# Altium project PCB_Practise_Enterprise.PrjPcb
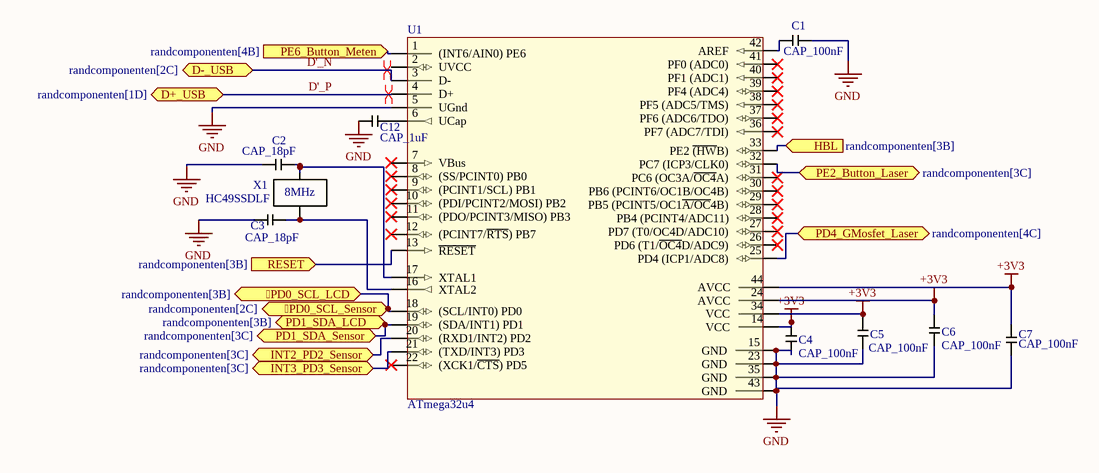
[diagram p0: chip.SchDoc]
2 sheets, 43 parts. Net scope: flat (ports and power ports of the same name join across sheets).
Board file: PCB2.PcbDoc
Sheets:
  chip.SchDoc
  randcomponenten.SchDoc

## Sheet chip.SchDoc
size A; SheetNumber: 1; SheetTotal: 2

### Parts
C1  CAP_100nF  [CAP_100nF]
C2  CAP_18pF  [CAP_18pF]
C3  CAP_18pF  [CAP_18pF]
C4  CAP_100nF  [CAP_100nF]
C5  CAP_100nF  [CAP_100nF]
C6  CAP_100nF  [CAP_100nF]
C7  CAP_100nF  [CAP_100nF]
C12  CAP_1uF  [CAP_1uF]
U1  ATmega32u4  [Atmega32u4]
X1  HC49SSDLF  [Xtal_HC49SSDLF]

### Ports
PD0_SCL_LCD (bidir, see randcomponenten[3B]), PD0_SCL_Sensor (bidir, see randcomponenten[2C]), D+_USB (bidir, see randcomponenten[1D]), D-_USB (bidir, see randcomponenten[2C]), HBL (in, see randcomponenten[3B]), INT2_PD2_Sensor (bidir, see randcomponenten[3C]), INT3_PD3_Sensor (bidir, see randcomponenten[3C]), PD1_SDA_LCD (bidir, see randcomponenten[3B]), PD1_SDA_Sensor (bidir, see randcomponenten[3C]), PD4_GMosfet_Laser (bidir, see randcomponenten[4C]), PE2_Button_Laser (bidir, see randcomponenten[3C]), PE6_Button_Meten (in, see randcomponenten[4B]), RESET (in, see randcomponenten[3B])

### Nets
+3V3: C4.1 C5.1 C6.1 C7.2 U1.14(VCC) U1.24(AVCC) U1.34(VCC) U1.44(AVCC)  [project net PINH_Vout]
GND: C1.2 C2.2 C3.2 C4.2 C5.2 C6.2 C7.1 C12.1 U1.5(UGnd) U1.15(GND) U1.23(GND) U1.35(GND) U1.43(GND)
D'_N: U1.3(D-) ; port D-_USB
D'_P: U1.4(D+) ; port D+_USB
NetC1_1: C1.1 U1.42(AREF)
NetC2_1: C2.1 U1.17(XTAL1) X1.1(Xtal_1)
NetC3_1: C3.1 U1.16(XTAL2) X1.2(Xtal__2)
NetC12_2: C12.2 U1.6(UCap)
NetDS1_1: U1.18((SCL/INT0)_PD0) ; port PD0_SCL_Sensor, port PD0_SCL_LCD
NetDS1_2: U1.19((SDA/INT1)_PD1) ; port PD1_SDA_Sensor, port PD1_SDA_LCD
NetQ2_G1: U1.25(PD4_(ICP1/ADC8)) ; port PD4_GMosfet_Laser
NetR1_1: U1.33(PE2_~{(HW}B)) ; port HBL
NetR4_1: U1.32(PC7_(ICP3/CLK0)) ; port PE2_Button_Laser
NetR13_1: U1.1((INT6/AIN0)_PE6) ; port PE6_Button_Meten
NetR14_1: U1.13(~{RESET}) ; port RESET
NetU1_20: U1.20((RXD1/INT2)_PD2) ; port INT2_PD2_Sensor
NetU1_21: U1.21((TXD/INT3)_PD3) ; port INT3_PD3_Sensor

Not connected (* = marked no-connect by the designer): U1 2(UVCC) 7(VBus)* 8((SS/PCINT0)_PB0)* 9((PCINT1/SCL)_PB1)* 10((PDI/PCINT2/MOSI)_PB2)* 11((PDO/PCINT3/MISO)_PB3)* 12((PCINT7/~{RTS})_PB7)* 22((XCK1/~{CTS})_PD5)* 26(PD6_(T1/~{OC4}D/ADC9))* 27(PD7_(T0/OC4D/ADC10))* 28(PB4_(PCINT4/ADC11))* 29(PB5_(PCINT5/OC1~{A/OC}4B))* 30(PB6_(PCINT6/OC1B/OC4B))* 31(PC6_(OC3A/~{OC4}A))* 36(PF7_(ADC7/TDI))* 37(PF6_(ADC6/TDO))* 38(PF5_(ADC5/TMS))* 39(PF4_(ADC4))* 40(PF1_(ADC1))* 41(PF0_(ADC0))*

### Layout directives
differential pair: D'_N, D'_P

### Notes on the sheet
- (in symbol XTAL_8MHz) 8MHz

### Library data of the parts
X1 = XTAL_8MHz

## Sheet randcomponenten.SchDoc
size A; SheetNumber: 2; SheetTotal: 2
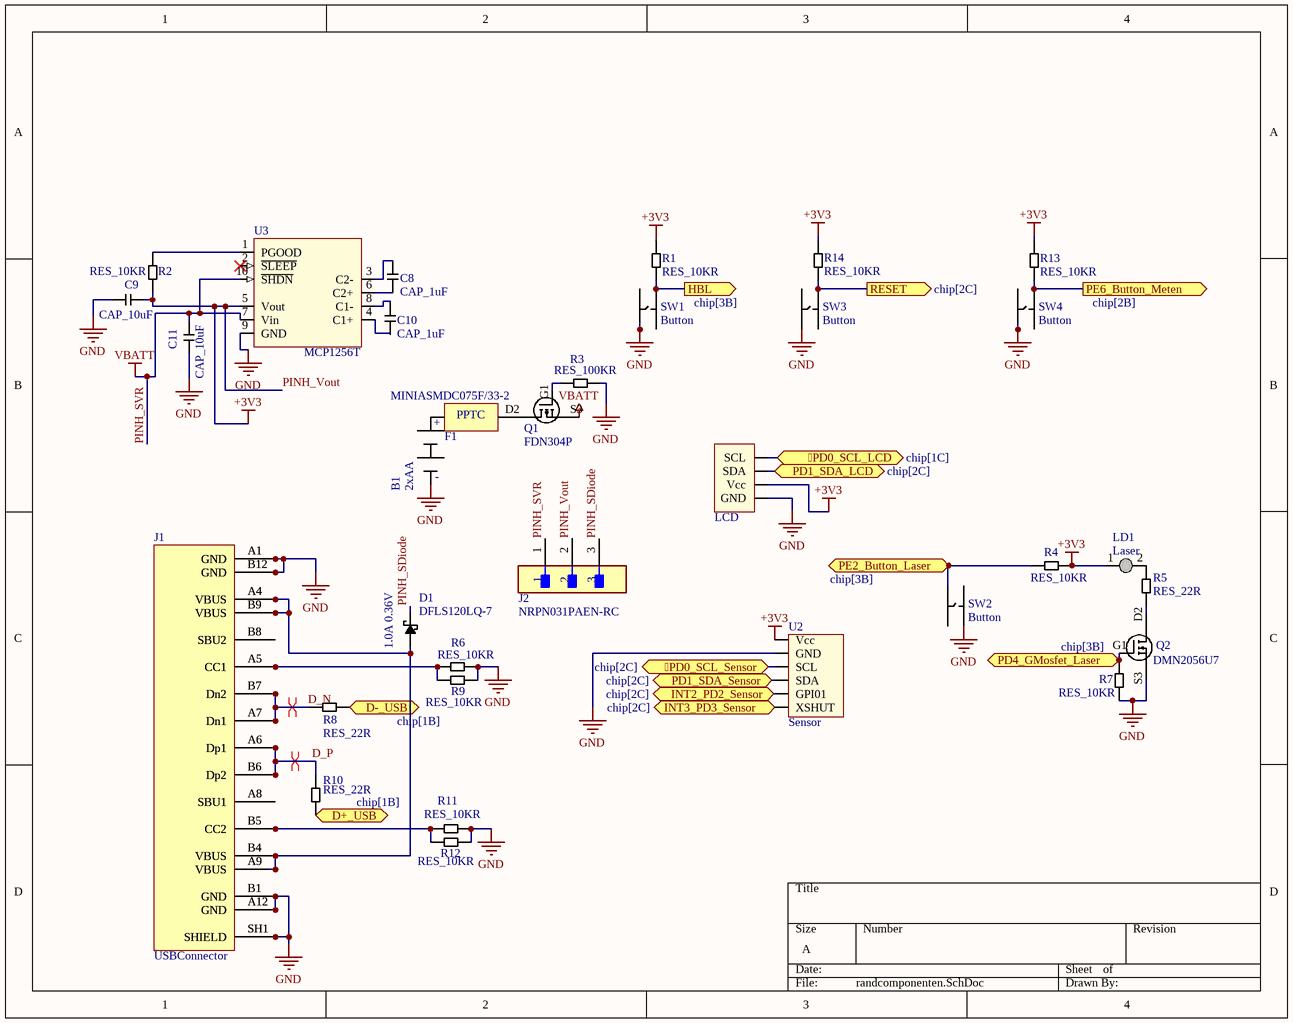
[diagram p1: randcomponenten.SchDoc]

### Parts
B1  2xAA  [BATTERIJHOUDER]
C8  CAP_1uF  [CAP_1uF]
C9  CAP_10uF  [CAP_10uF]
C10  CAP_1uF  [CAP_1uF]
C11  CAP_10uF  [CAP_10uF]
D1  DFLS120LQ-7  [SDIODE]
DS1  LCD  [LCD3V3]
F1  MINIASMDC075F/33-2  [RESC4632X15M]
J1  USBConnector  [USBC]
J2  NRPN031PAEN-RC  [FP-NRPN031PAEN-RC-MFG]
LD1  Laser  [laser]
Q1  FDN304P  [FDN304P]
Q2  DMN2056U7  [DMN2056U-7]
R1  RES_10KR  [RES_10KR]
R2  RES_10KR  [RES_10KR]
R3  RES_100KR  [RES_100KR]
R4  RES_10KR  [RES_10KR]
R5  RES_22R  [RES_22R]
R6  RES_10KR  [RES_10KR]
R7  RES_10KR  [RES_10KR]
R8  RES_22R  [RES_22R]
R9  RES_10KR  [RES_10KR]
R10  RES_22R  [RES_22R]
R11  RES_10KR  [RES_10KR]
R12  RES_10KR  [RES_10KR]
R13  RES_10KR  [RES_10KR]
R14  RES_10KR  [RES_10KR]
SW1  Button  [BUTTON]
SW2  Button  [BUTTON]
SW3  Button  [BUTTON]
SW4  Button  [BUTTON]
U2  Sensor  [Vl53l1x]
U3  MCP1256T  [MCP1256T]

### Ports
PD0_SCL_LCD (bidir, see chip[1C]), PD0_SCL_Sensor (bidir, see chip[2C]), D+_USB (bidir, see chip[1B]), D-_USB (bidir, see chip[1B]), HBL (out, see chip[3B]), INT2_PD2_Sensor (bidir, see chip[2C]), INT3_PD3_Sensor (bidir, see chip[2C]), PD1_SDA_LCD (bidir, see chip[2C]), PD1_SDA_Sensor (bidir, see chip[2C]), PD4_GMosfet_Laser (bidir, see chip[3B]), PE2_Button_Laser (bidir, see chip[3B]), PE6_Button_Meten (out, see chip[2B]), RESET (out, see chip[2C])

### Nets
GND: B1.2 C9.1 C11.1 DS1.4(GND) J1.A1(GND) J1.A12(GND) J1.B1(GND) J1.B12(GND) J1.SH1(SHIELD) Q2.S3(Source) R3.2 R6.1 R7.2 R9.1 R11.1 R12.1 SW1.1 SW2.3 SW3.1 SW4.1 U2.2(GND) U3.9(GND)
PINH_SVR: C11.2 J2.1 Q1.S3(Source) U3.7(Vin) U3.10(~{SHDN})  [also labelled VBATT]
PINH_Vout: C9.2 DS1.3(Vcc) J2.2 LD1.1(+) R1.2 R2.2 R4.2 R13.2 R14.2 U2.1(Vcc) U3.5(Vout)  [also labelled +3V3]
D'_N: R8.1 ; port D-_USB
D'_P: R10.2 ; port D+_USB
D_N: J1.A7(Dn1) J1.B7(Dn2) R8.2
D_P: J1.A6(Dp1) J1.B6(Dp2) R10.1
PINH_SDiode: D1.2 J2.3
NetB1_1: B1.1 F1.1
NetC8_1: C8.1 U3.6(C2+)
NetC8_2: C8.2 U3.3(C2-)
NetC10_1: C10.1 U3.4(C1+)
NetC10_2: C10.2 U3.8(C1-)
NetD1_1: D1.1 J1.A4(VBUS) J1.A9(VBUS) J1.B4(VBUS) J1.B9(VBUS)
NetDS1_1: DS1.1(SCL) U2.3(SCL) ; port PD0_SCL_LCD, port PD0_SCL_Sensor
NetDS1_2: DS1.2(SDA) U2.4(SDA) ; port PD1_SDA_LCD, port PD1_SDA_Sensor
NetF1_2: F1.2 Q1.D2(Drain)
NetJ1_A5: J1.A5(CC1) R6.2 R9.2
NetJ1_B5: J1.B5(CC2) R11.2 R12.2
NetLD1_2: LD1.2(-) R5.2
NetQ1_G1: Q1.G1(Gate) R3.1
NetQ2_D2: Q2.D2(Drain) R5.1
NetQ2_G1: Q2.G1(Gate) R7.1 ; port PD4_GMosfet_Laser
NetR1_1: R1.1 SW1.4 ; port HBL
NetR2_1: R2.1 U3.1(PGOOD)
NetR4_1: R4.1 SW2.2 ; port PE2_Button_Laser
NetR13_1: R13.1 SW4.4 ; port PE6_Button_Meten
NetR14_1: R14.1 SW3.4 ; port RESET
NetU1_20: U2.5(GPI01) ; port INT2_PD2_Sensor
NetU1_21: U2.6(XSHUT) ; port INT3_PD3_Sensor

Not connected (* = marked no-connect by the designer): J1 A8(SBU1) B8(SBU2); SW1 2 3; SW2 1 4; SW3 2 3; SW4 2 3; U3 2(~{SLEEP})*

### Layout directives
differential pair: D_N, D_P

### Notes on the sheet
- (in symbol 2xAA) +; -
- (in symbol DFLS120LQ-7) 1.0A 0.36V
- (in symbol MINIASMDC075F/33-2) PPTC

### Library data of the parts
B1 = 2xAA: Batterijhouder
D1 = DFLS120LQ-7: Schottky Diode
F1 = MINIASMDC075F/33-2: Fuse
J1 = USBConnector: pin to pad: A1>A1_B12 A4>A4_B9 A9>B4_A9 A12>B1_A12 B1>B1_A12 B4>B4_A9 B9>A4_B9 B12>A1_B12
J2 = CMP-25680-000021-1: CONN HEADER VERT 3POS 2MM; Manufacturer: Sullins; Number Of Contacts: 3; Conn Orientation: Straight; Voltage Rating: 150V; Conn Gender: Male; Current Rating: 2A; Temperature Range High: +105°C; Category: Conn; Manufacturer Part Number: NRPN031PAEN-RC; RoHS: TRUE; Contact Material: Gold,Nickel; ComponentLink2URL: https://drawings-pdf.s3.amazonaws.com/10531.pdf; Temperature: -40°C to +105°C; Lead Free: Yes; Octopart: https://octopart.com/nrpn031paen-rc-sullins-12817732; ComponentLink2Description: Datasheet; Pitch: 2mm; Number Of Rows: 1; Automotive: No; Height: 6mm; Device Class L2: Headers and Wire Housings; Digikey Description: CONN HEADER VERT 3POS 2MM; Package: 0; Device Class L3: unset; Temperature Range Low: -40°C; Device Class L1: Connectors
Q1 = FDN304P: p-mosfet
Q2 = DMN2056U7: n-mosfet
U3 = MCP1256T: Switching Voltage Regulator

## Nets that join several sheets
GND: chip (13 pins), randcomponenten (22 pins)
PINH_Vout: chip (8 pins), randcomponenten (11 pins)
D'_N: chip (U1.3), randcomponenten (R8.1)
D'_P: chip (U1.4), randcomponenten (R10.2)
NetDS1_1: chip (U1.18), randcomponenten (DS1.1 U2.3)
NetDS1_2: chip (U1.19), randcomponenten (DS1.2 U2.4)
NetQ2_G1: chip (U1.25), randcomponenten (Q2.G1 R7.1)
NetR1_1: chip (U1.33), randcomponenten (R1.1 SW1.4)
NetR4_1: chip (U1.32), randcomponenten (R4.1 SW2.2)
NetR13_1: chip (U1.1), randcomponenten (R13.1 SW4.4)
NetR14_1: chip (U1.13), randcomponenten (R14.1 SW3.4)
NetU1_20: chip (U1.20), randcomponenten (U2.5)
NetU1_21: chip (U1.21), randcomponenten (U2.6)